# Altium schematic sheet panel_board.SchDoc
size A4
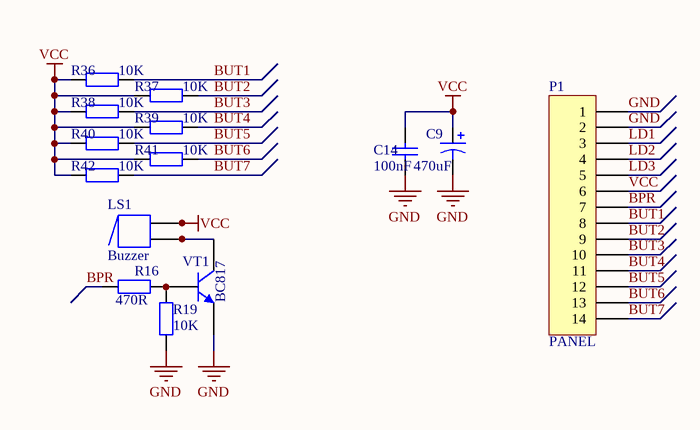
[diagram p0: panel_board.SchDoc]

## Parts
C9  value 470uF  [CAPAE200P550X1200_FLAT1]  (hidden comment: Cap Pol1)
C14  value 100nF  [CAPC2012X135N]  (hidden comment: C0805)
LS1  Buzzer  [ABSM-1574]
P1  PANEL  [14P_PCB_HEADER_BRD_MNT]
R16  value 470R  [RESC2012X70N]  (hidden comment: Res2)
R19  value 10K  [RESC2012X70N]  (hidden comment: Res2)
R36  value 10K  [RESC2012X70N]  (hidden comment: Res2)
R37  value 10K  [RESC2012X70N]  (hidden comment: Res2)
R38  value 10K  [RESC2012X70N]  (hidden comment: Res2)
R39  value 10K  [RESC2012X70N]  (hidden comment: Res2)
R40  value 10K  [RESC2012X70N]  (hidden comment: Res2)
R41  value 10K  [RESC2012X70N]  (hidden comment: Res2)
R42  value 10K  [RESC2012X70N]  (hidden comment: Res2)
VT1  BC817  [SOT23-3]

## Nets
GND: C9.2 C14.1 P1.1 P1.2 R19.1 VT1.3(E)
VCC: C9.1 C14.2 LS1.1 LS1.1A P1.6 R36.1 R37.1 R38.1 R39.1 R40.1 R41.1 R42.1
BPR: P1.7 R16.1
BUT1: P1.8 R36.2
BUT2: P1.9 R37.2
BUT3: P1.10 R38.2
BUT4: P1.11 R39.2
BUT5: P1.12 R40.2
BUT6: P1.13 R41.2
BUT7: P1.14 R42.2
LD1: P1.3
LD2: P1.4
LD3: P1.5
NetLS1_2: LS1.2 LS1.2A VT1.1(C)
NetR16_2: R16.2 R19.2 VT1.2(B)

## Library data of the parts
C9 = Cap Pol1: Polarized Capacitor (Radial); Published: 8-Jun-2000; LatestRevisionDate: 17-Jul-2002; LatestRevisionNote: Re-released for DXP Platform.; PackageReference: RB7.6-15; Publisher: Altium Limited; PackageDescription: Polarized Capacitor (Radial); 2 Leads
C14 = C0805: Ceramic Chip Capacitor - Standard; Note: Footprint corresponds to dimensions for bulk cassette packaging. This case size has tightened tolerances.; Published: 17-Jul-2002; LatestRevisionDate: 19-Mar-2004; LatestRevisionNote: Silkscreen size reduced.; DatasheetDocument: Mar-2001; PackageDocument: Mar-2001; PackageReference: 0805; Publisher: Altium Limited; Code_JEITA: 0805; Code_IPC: 2012[0805]; ComponentLink1Description: Manufacturer Link; ComponentLink1URL: http://www.kemet.com/; ComponentLink2Description: Datasheet; ComponentLink2URL: http://www.kemet.com/kemet/web/homepage/kechome.nsf/vapubfilesname/F3102TA.pdf/$file/F3102TA.pdf
LS1 = Buzzer: Magnetic Transducer Buzzer; Published: 24-Mar-1999; LatestRevisionDate: 17-Dec-2003; LatestRevisionNote: Schematic revised, PCB Footprint replaced.; DatasheetVersion: 17-Dec-2003; PackageReference: ABSM-1574; Publisher: Altium Limited; PackageDescription: Magnetic Transducer Buzzer; ComponentLink1Description: Manufacturer Link; ComponentLink1URL: http://www.megastar.com/linecard/buzzmode/index.php
P1 = Header 14: Header, 14-Pin; LatestRevisionDate: 17-Jul-2002; LatestRevisionNote: Re-released for DXP Platform.; Publisher: Altium Limited
R16 R19 R36-R42 = Res2: Resistor; Published: 8-Jun-2000; LatestRevisionDate: 17-Jul-2002; LatestRevisionNote: Re-released for DXP Platform.; PackageReference: AXIAL-0.4; Publisher: Altium Limited; PackageDescription: Axial Device, Thru-Hole; 2 Leads; 0.4 in Pin Spacing
VT1 = QNPN: NPN Bipolar Transistor; pin to pad: 1>3 3>1; Published: 8-Jun-2000; LatestRevisionDate: 29-May-2009; LatestRevisionNote: IPC-7351 Footprint Added.; PackageVersion: Aug-1999; PackageReference: SOT-23B; Publisher: Altium Limited; PackageDescription: 3-Pin SOT-23 Package 0.95 mm Pitch, 2.4 mm Lead Span